# Altium schematic sheet 按键.SchDoc: 分区电源管理电路板-按键
size A4; Organization: 智能实训室产品部; Address1: 广东省深圳市; Address2: 宝安区石岩凯普达工业园; DocumentNumber: 190416; Revision: V1.0; SheetNumber: 4; SheetTotal: 6; Date: 2019-4-24; ApprovedBy: 杨青; CheckedBy: 杨青; DrawnBy: 杨青; Engineer: 杨青; ProjectName_GTA: 实训室智能化管理系统; PCB Number: GS-P1B-GXO02
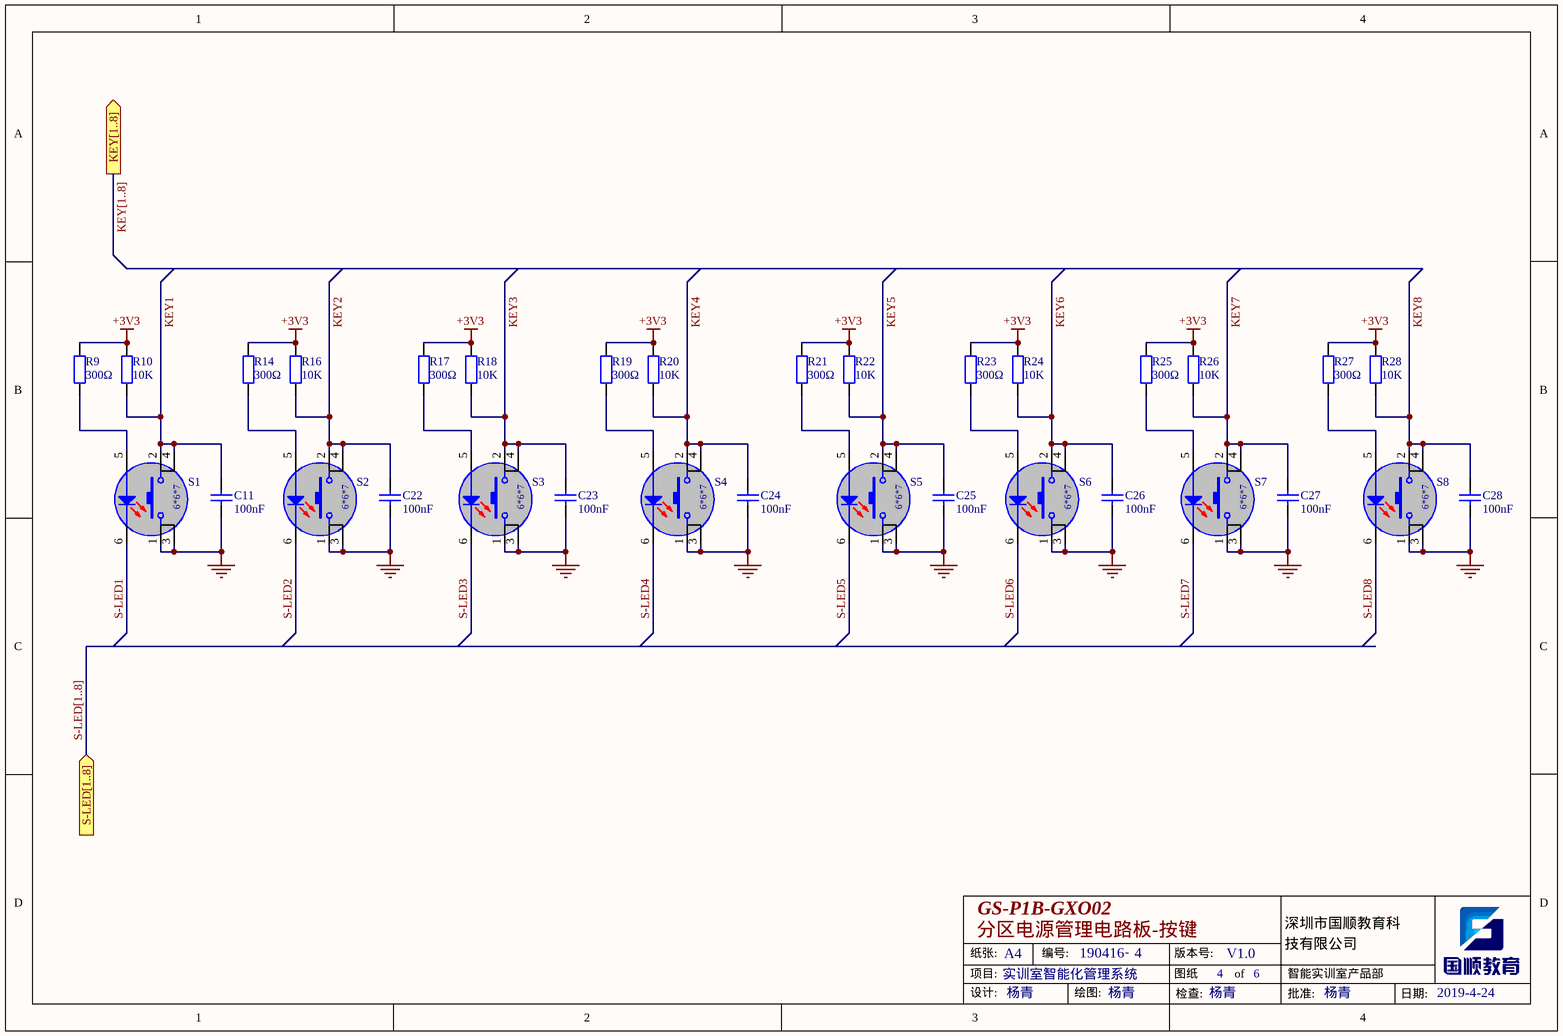
[diagram p0: 按键.SchDoc]

## Parts
C11  100nF  [C0603]
C22  100nF  [C0603]
C23  100nF  [C0603]
C24  100nF  [C0603]
C25  100nF  [C0603]
C26  100nF  [C0603]
C27  100nF  [C0603]
C28  100nF  [C0603]
R9  300Ω  [R0603]
R10  10K  [R0603]
R14  300Ω  [R0603]
R16  10K  [R0603]
R17  300Ω  [R0603]
R18  10K  [R0603]
R19  300Ω  [R0603]
R20  10K  [R0603]
R21  300Ω  [R0603]
R22  10K  [R0603]
R23  300Ω  [R0603]
R24  10K  [R0603]
R25  300Ω  [R0603]
R26  10K  [R0603]
R27  300Ω  [R0603]
R28  10K  [R0603]
S1  6X6X7  [SW2-6X6X7-Lamp]  (value not drawn)
S2  6X6X7  [SW2-6X6X7-Lamp]  (value not drawn)
S3  6X6X7  [SW2-6X6X7-Lamp]  (value not drawn)
S4  6X6X7  [SW2-6X6X7-Lamp]  (value not drawn)
S5  6X6X7  [SW2-6X6X7-Lamp]  (value not drawn)
S6  6X6X7  [SW2-6X6X7-Lamp]  (value not drawn)
S7  6X6X7  [SW2-6X6X7-Lamp]  (value not drawn)
S8  6X6X7  [SW2-6X6X7-Lamp]  (value not drawn)

## Ports
KEY[1..8] (out), S-LED[1..8] (in)

## Nets
+3V3: R9.1 R10.1 R14.1 R16.1 R17.1 R18.1 R19.1 R20.1 R21.1 R22.1 R23.1 R24.1 R25.1 R26.1 R27.1 R28.1
GND: C11.1 C22.1 C23.1 C24.1 C25.1 C26.1 C27.1 C28.1 S1.1 S1.3 S2.1 S2.3 S3.1 S3.3 S4.1 S4.3 S5.1 S5.3 S6.1 S6.3 S7.1 S7.3 S8.1 S8.3
KEY1: C11.2 R10.2 S1.2 S1.4
KEY2: C22.2 R16.2 S2.2 S2.4
KEY3: C23.2 R18.2 S3.2 S3.4
KEY4: C24.2 R20.2 S4.2 S4.4
KEY5: C25.2 R22.2 S5.2 S5.4
KEY6: C26.2 R24.2 S6.2 S6.4
KEY7: C27.2 R26.2 S7.2 S7.4
KEY8: C28.2 R28.2 S8.2 S8.4
S-LED1: S1.6
S-LED2: S2.6
S-LED3: S3.6
S-LED4: S4.6
S-LED5: S5.6
S-LED6: S6.6
S-LED7: S7.6
S-LED8: S8.6
NetR9_2: R9.2 S1.5
NetR14_2: R14.2 S2.5
NetR17_2: R17.2 S3.5
NetR19_2: R19.2 S4.5
NetR21_2: R21.2 S5.5
NetR23_2: R23.2 S6.5
NetR25_2: R25.2 S7.5
NetR27_2: R27.2 S8.5

## Buses and harness runs
bus KEY[1..8] = port KEY[1..8]
bus S-LED[1..8] = port S-LED[1..8]

## Notes on the sheet
- 纸张:
- 项目:
- A4
- 编号:
- -
- 版本号:
- 图纸
- of
- 深圳市国顺教育科
- 技有限公司
- 设计:
- 绘图:
- 检查:
- 批准:
- 日期:
- (in symbol SW-PB_6X6X7-6P-LAMP) 6*6*7

## Library data of the parts
C11 C22-C28 = 100nF_50V_0603: Capacitor; 编码: 无; 规格/型号: 100nF,50V,0603; 物料名称: 贴片电容
R9 R14 R17 R19 R21 R23 R25 R27 = 300Ω_5%_0603: 300Ω,±5%,0603; 物料名称: 贴片电阻; 单价: 0.02; 规格/型号: 300Ω,±5%,0603; 参数: ±5%
R10 R16 R18 R20 R22 R24 R26 R28 = 10K_5%_0603: 10K,±5%,0603; 物料名称: 贴片电阻; 单价: 0.02; 规格/型号: 10K,±5%,0603; 参数: ±5%
S1-S8 = SW-PB_6X6X7-6P-LAMP: 6X6X7,带灯,6PIN; 规格/型号: 轻触开关,6*6*7,带灯,6脚; 物料名称: 插针式带灯开关